# EAGLE design Termrf (EAGLE 5.07)
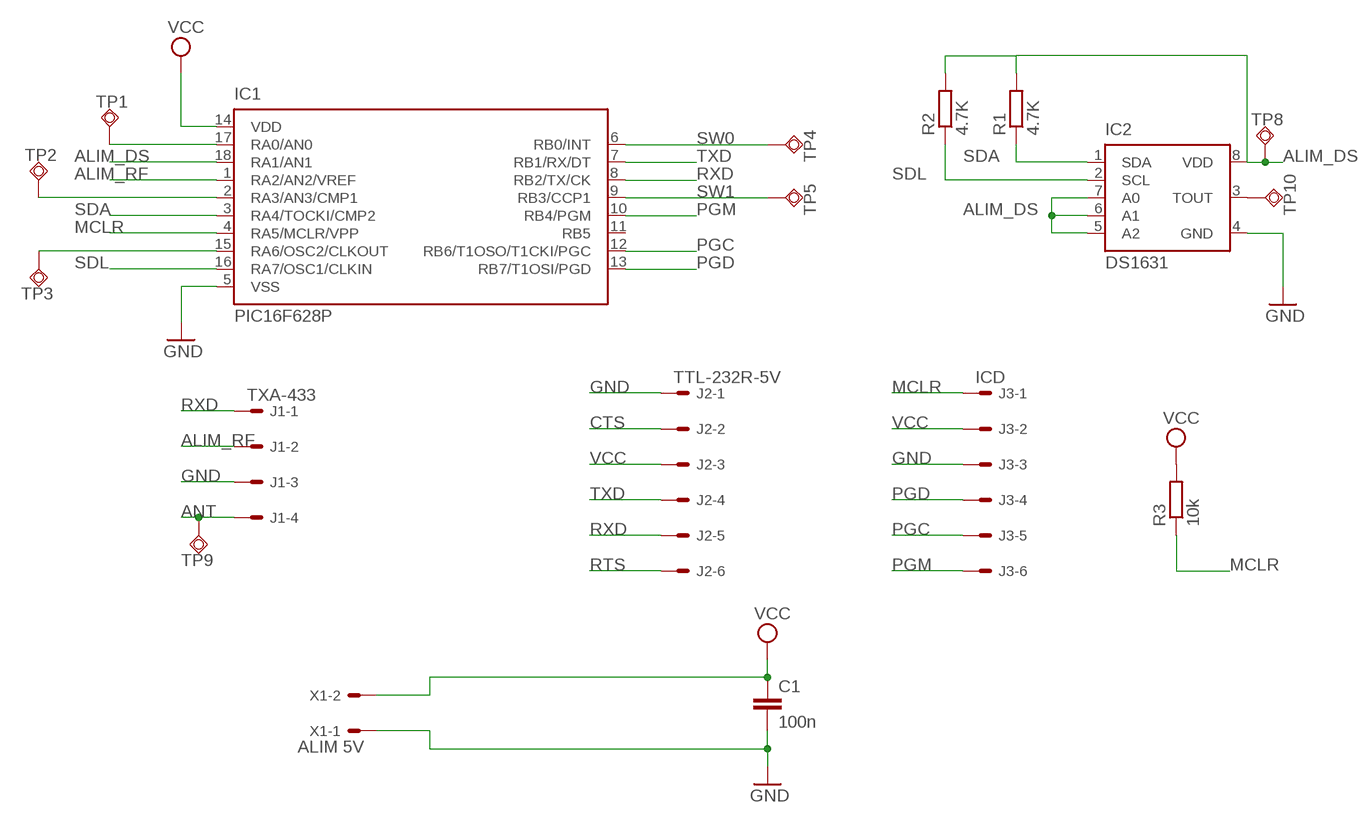
[diagram p0: schematic, sheet 1]

## Parts
C1  100n  C-EU050-035X075  [C050-035X075]
IC1  PIC16F628P  [DIL18]
IC2  DS1631  DS1621  [DIL08]
J1  TXA-433  22-27-2041-04  [6410-04]
J2  TTL-232R-5V  22-27-2061-06  [6410-06]
J3  ICD  22-27-2061-06  [6410-06]
R1  4.7K  R-EU_0309/12  [0309/12]
R2  4.7K  R-EU_0309/12  [0309/12]
R3  10k  R-EU_0309/10  [0309/10]
TP1  TPSQPAD1-13  [P1-13]
TP2  TPSQPAD1-13  [P1-13]
TP3  TPSQPAD1-13  [P1-13]
TP4  TPSQPAD1-13  [P1-13]
TP5  TPSQPAD1-13  [P1-13]
TP8  TPSQPAD1-13  [P1-13]
TP9  TPSQPAD1-13  [P1-13]
TP10  TPSQPAD1-13  [P1-13]
X1  ALIM 5V  22-23-2021  [22-23-2021]

## Nets
ALIM_DS: IC1.18(RA1/AN1) IC2.5(A2) IC2.6(A1) IC2.7(A0) IC2.8(VDD) R1.2 R2.2 TP8.TP
ALIM_RF: IC1.1(RA2/AN2/VREF) J1.2
ANT: J1.4 TP9.TP
CTS: J2.2
GND: C1.2 IC1.5(VSS) IC2.4(GND) J1.3 J2.1 J3.3 X1.1
MCLR: IC1.4(RA5/MCLR/VPP) J3.1 R3.1
N$2: IC1.17(RA0/AN0) TP1.TP
N$3: IC1.2(RA3/AN3/CMP1) TP2.TP
N$4: IC1.15(RA6/OSC2/CLKOUT) TP3.TP
N$5: IC2.3(TOUT) TP10.TP
PGC: IC1.12(RB6/T1OSO/T1CKI/PGC) J3.5
PGD: IC1.13(RB7/T1OSI/PGD) J3.4
PGM: IC1.10(RB4/PGM) J3.6
RTS: J2.6
RXD: IC1.8(RB2/TX/CK) J1.1 J2.5
SDA: IC1.3(RA4/TOCKI/CMP2) IC2.1(SDA) R1.1
SDL: IC1.16(RA7/OSC1/CLKIN) IC2.2(SCL) R2.1
SW0: IC1.6(RB0/INT) TP4.TP
SW1: IC1.9(RB3/CCP1) TP5.TP
TXD: IC1.7(RB1/RX/DT) J2.4
VCC: C1.1 IC1.14(VDD) J2.3 J3.2 R3.2 X1.2
Unconnected: IC1.11(RB5)

## Library data of the parts
C1 = resistor:C-EU: CAPACITOR, European symbol
IC1 = microchip:PIC16F62*: FLASH-Based 8-Bit CMOS Microcontroller Source: http://ww1.microchip.com/downloads/en/DeviceDoc/40300C.pdf
IC2 = maxim:DS1621: Digital Thermometer and Thermostat Source: http://pdfserv.maxim-ic.com/en/ds/DS1621.pdf
J1 = con-molex:22-?-04: CONNECTOR wire to board 2.54 mm (.1 inch) pitch header
J2 J3 = con-molex:22-?-06: CONNECTOR wire to board 2.54 mm (.1 inch) pitch header
R1 R2 = resistor:R-EU_: RESISTOR, European symbol
R3 = rcl:R-EU_: RESISTOR, European symbol
TP1-TP5 TP8-TP10 = testpad:TPSQ: Test pad
X1 = con-molex:22-23-2021: .100" (2.54mm) Center Header - 2 Pin

## Board
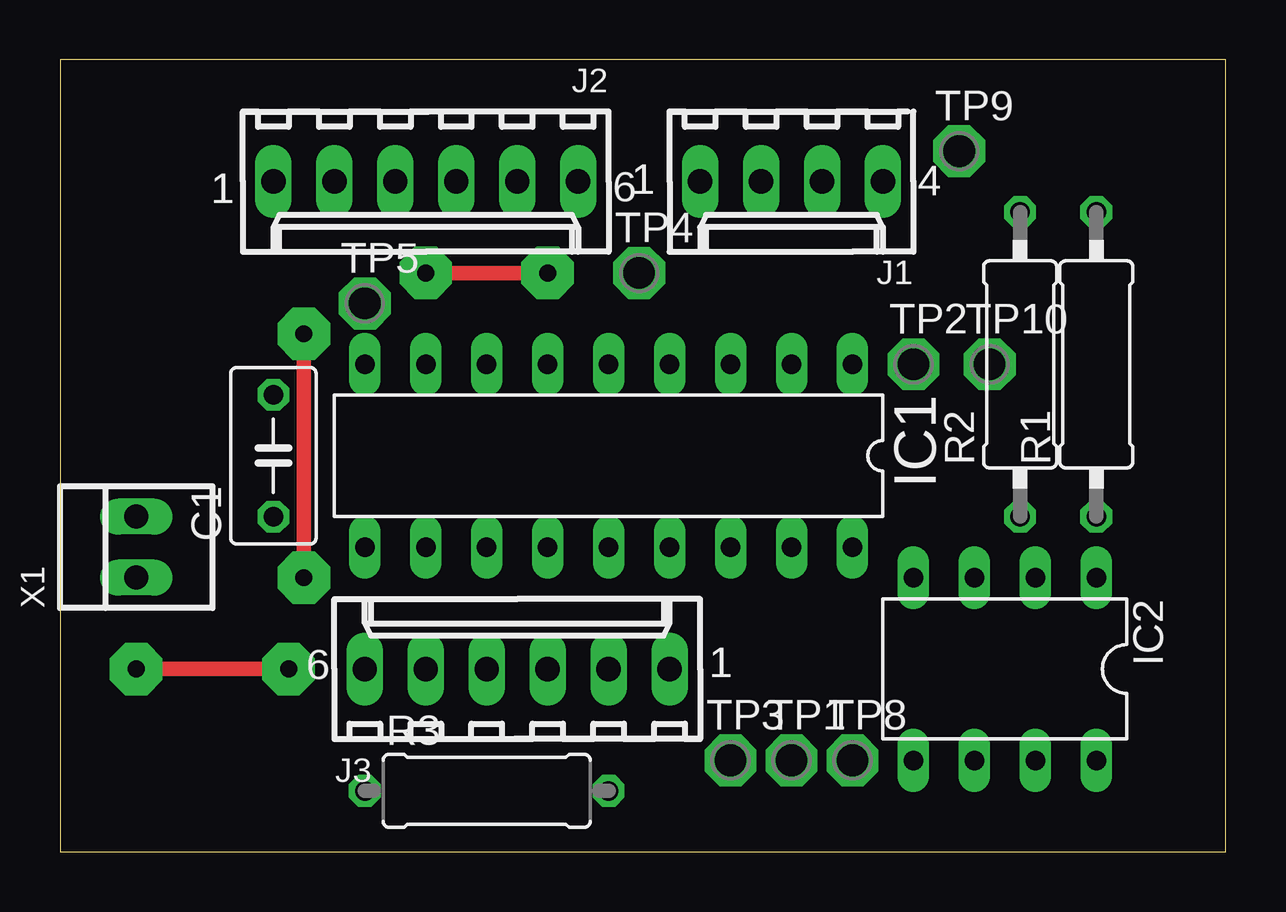
[diagram p1: board, top side]
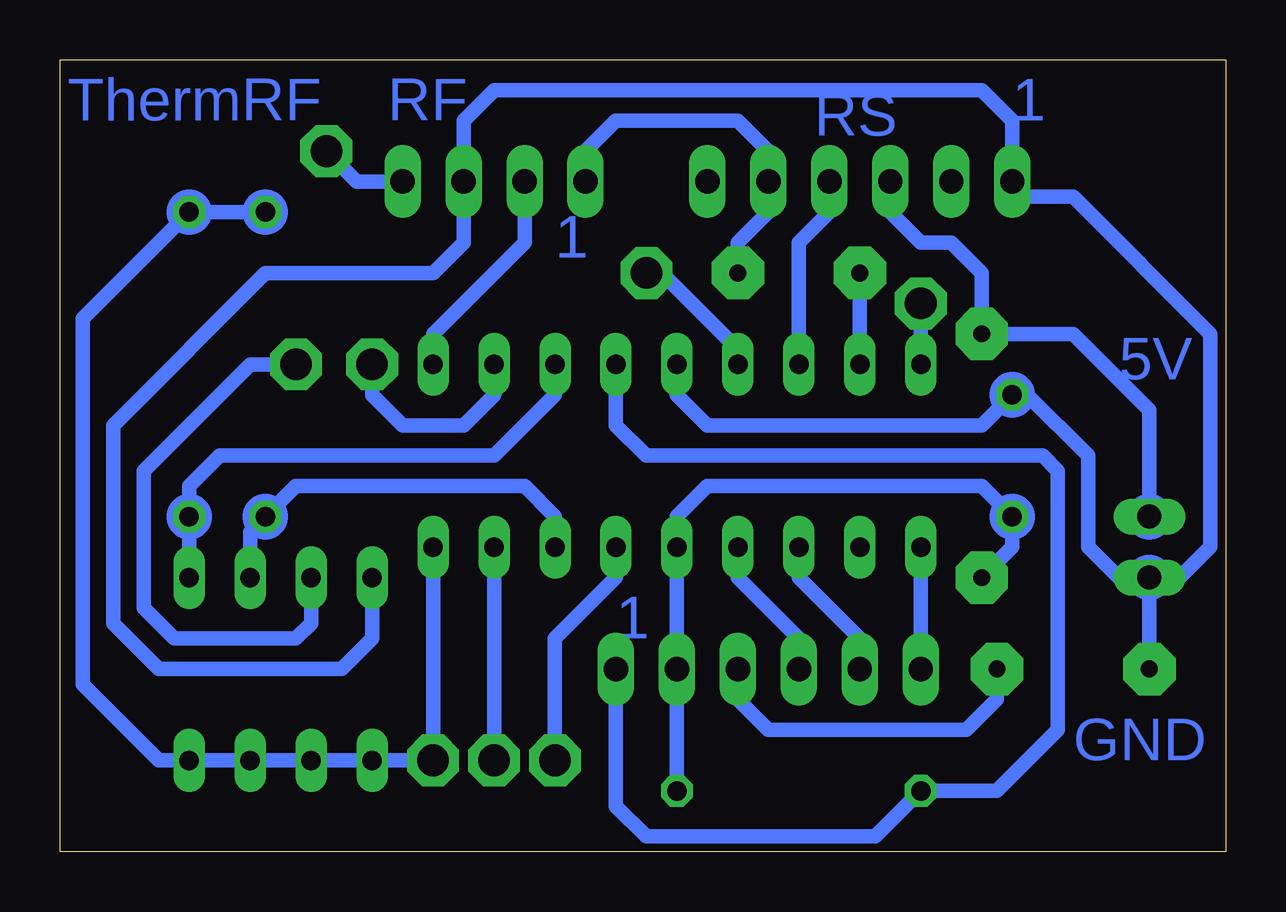
[diagram p2: board, bottom side, seen from below]

Size 48.56 x 33.01 mm. Coordinates in mm from the lower left corner, seen from the top.
Outline: 0,0 48.56,0 48.56,33.01 0,33.01 0,0
Copper layers (1*16): Top 0.035mm / dielectric 1.5mm / Bottom 0.035mm
Design rules "default": minimum track width 10mil, minimum drill 24mil, track to track 8mil, track to pad 8mil, pad to pad 8mil, via to via 8mil, smd to smd 8mil, copper to edge 40mil, drill to drill 8mil, minimum pad ring 10mil, minimum via ring 8mil, stop-mask expansion 4mil, vias tented up to drill 0mil, thermal gap 10mil

### Footprints (pad centres in the part's own frame; a part is rotated, then mirrored left to right if it is on the bottom)
C050-035X075 = drill 0.813 octagon: 1 -2.54,0; 2 2.54,0
DIL18 = drill 0.813 long: 1 -10.16,-3.81; 2 -7.62,-3.81; 3 -5.08,-3.81; 4 -2.54,-3.81; 5 0,-3.81; 6 2.54,-3.81; 7 5.08,-3.81; 8 7.62,-3.81; 9 10.16,-3.81; 10 10.16,3.81; 11 7.62,3.81; 12 5.08,3.81; 13 2.54,3.81; 14 0,3.81; 15 -2.54,3.81; 16 -5.08,3.81; 17 -7.62,3.81; 18 -10.16,3.81
DIL08 = drill 0.813 long: 1 -3.81,-3.81; 2 -1.27,-3.81; 3 1.27,-3.81; 4 3.81,-3.81; 5 3.81,3.81; 6 1.27,3.81; 7 -1.27,3.81; 8 -3.81,3.81
6410-04 = drill 1.016 long: 1 3.81,0; 2 1.27,0; 3 -1.27,0; 4 -3.81,0
6410-06 = drill 1.016 long: 1 6.35,0; 2 3.81,0; 3 1.27,0; 4 -1.27,0; 5 -3.81,0; 6 -6.35,0
0309/12 = drill 0.813 octagon: 1 -6.35,0; 2 6.35,0
0309/10 = drill 0.813 octagon: 1 -5.08,0; 2 5.08,0
P1-13 = drill 1.321 pad 2.159 octagon: TP 0,0
22-23-2021 = drill 1 long: 1 -1.27,0; 2 1.27,0

### Placement (x,y rotation side)
C1  8.89,16.51 90 top
IC1  22.86,16.51 180 top
IC2  39.37,7.62 180 top
J1  30.48,27.94 180 top
J2  15.24,27.94 180 top
J3  19.05,7.62 0 top
R1  43.18,20.32 90 top
R2  40.01,20.32 90 top
R3  17.78,2.54 0 top
TP1  30.48,3.81 0 top
TP2  35.56,20.32 0 top
TP3  27.94,3.81 0 top
TP4  24.13,24.13 0 top
TP5  12.7,22.86 0 top
TP8  33.02,3.81 0 top
TP9  37.47,29.21 0 top
TP10  38.73,20.32 0 top
X1  3.17,12.7 90 top

### Tracks (layer width: path | path; a pad name or v marks a point on that pad's centre or on a via)
ALIM_DS
  Bottom 0.61: IC1.18 TP8.TP IC2.5 IC2.6 IC2.7 IC2.8 44.45,3.81 47.62,6.98 47.62,22.22 R1.2 R2.2
ALIM_RF
  Bottom 0.61: J1.2 29.21,25.4 33.02,21.59 IC1.1
ANT
  Bottom 0.61: J1.4 36.2,27.94 TP9.TP
GND  (via drill 0.7 pad 2.18)
  Top 0.61: v3.17,7.62 v9.53,7.62
  Bottom 0.61: IC2.4 35.56,8.89 36.83,7.62 44.45,7.62 46.35,9.53 46.35,17.78 40.01,24.13 33.02,24.13 31.75,25.4 J1.3 31.75,30.48 30.48,31.75 10.16,31.75 8.89,30.48 J2.1 8.26,27.3 6.35,27.3 0.64,21.59 0.64,12.7 1.91,11.43 X1.1 | IC1.5 22.86,19.05 21.59,17.78 10.16,17.78 C1.2 8.26,19.05 5.71,16.51 5.71,12.7 4.45,11.43 X1.1 | J3.3 20.32,6.35 19.05,5.08 10.79,5.08 9.53,6.35 v9.53,7.62 | v3.17,7.62 X1.1
MCLR
  Bottom 0.61: J3.1 25.4,1.91 24.13,0.64 14.61,0.64 R3.1 9.53,2.54 6.99,5.08 6.99,15.88 7.62,16.51 24.13,16.51 25.4,17.78 IC1.4
N$2
  Bottom 0.61: TP1.TP IC1.17
N$3
  Bottom 0.61: IC1.2 30.48,19.05 31.75,17.78 34.29,17.78 35.56,19.05 TP2.TP
N$4
  Bottom 0.61: IC1.15 25.4,11.43 27.94,8.89 TP3.TP
N$5
  Bottom 0.61: IC2.3 38.1,9.53 38.73,8.89 43.81,8.89 45.09,10.16 45.09,15.88 40.64,20.32 TP10.TP
PGC
  Bottom 0.61: J3.5 15.24,8.89 17.78,11.43 IC1.12
PGD
  Bottom 0.61: J3.4 17.78,8.89 20.32,11.43 IC1.13
PGM
  Bottom 0.61: J3.6 IC1.10
RXD  (via drill 0.7 pad 2.18)
  Top 0.61: v15.24,24.13 v20.32,24.13
  Bottom 0.61: v20.32,24.13 20.32,25.4 19.05,26.67 J2.5 19.05,29.21 20.32,30.48 25.4,30.48 26.67,29.21 J1.1 | IC1.8 v15.24,24.13
SDA
  Bottom 0.61: IC2.1 R1.1 43.18,15.24 41.91,16.51 30.48,16.51 27.94,19.05 IC1.3
SDL
  Bottom 0.61: IC2.2 40.64,13.33 R2.1 38.73,15.24 29.21,15.24 27.94,13.97 IC1.16
SW0
  Bottom 0.61: IC1.6 20.32,20.95 23.5,24.13 TP4.TP
SW1
  Bottom 0.61: IC1.9 TP5.TP
TXD
  Bottom 0.61: IC1.7 17.78,25.4 16.51,26.67 J2.4
VCC  (via drill 0.7 pad 2.18)
  Top 0.61: v10.16,21.59 v10.16,11.43
  Bottom 0.61: J2.3 13.97,26.67 12.7,25.4 11.43,25.4 10.16,24.13 v10.16,21.59 6.35,21.59 3.17,18.41 X1.2 | v10.16,11.43 8.89,12.7 C1.1 10.16,15.24 21.59,15.24 22.86,13.97 IC1.14 J3.2 R3.2
(copper drawn outside any net)
  shapes: Bottom circle x16

### Text on the board
Bottom: 1 | RS | RF | ThermRF | 1 | 5V | 1 | GND